# Altium schematic sheet ATACS_SCH.SchDoc
size A
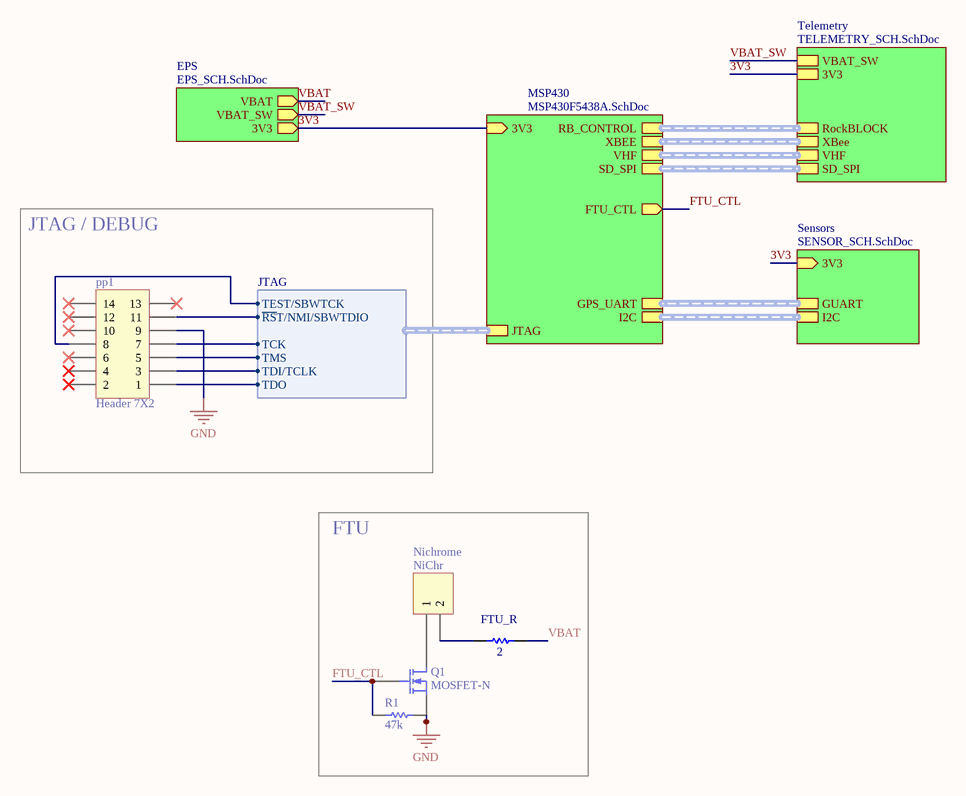
[diagram p0: ATACS_SCH.SchDoc]

## Parts
FTU_R  value 2  [*RES_SMW52R0JT]  (hidden comment: Resistor)
NiChr  Nichrome  [Nichrome]
pp1  Header 7X2  [HDR2X7]
Q1  MOSFET-N  [MOSFET]
R1  value 47k  [J1-0603]  (hidden comment: Resistor)

## Blocks framed on the sheet
JTAG / DEBUG: pp1
FTU: FTU_R NiChr Q1 R1

## Sub-sheets
EPS = EPS_SCH.SchDoc: 3V3 (out), VBAT (out), VBAT_SW (out)
MSP430 = MSP430F5438A.SchDoc: RB_CONTROL (harness RockBLOCK), GPS_UART (harness UART), JTAG (harness JTAG), VHF (harness APRS Transmitter), I2C (harness I2C), XBEE (harness Short-Range XBee), 3V3 (in), FTU_CTL (out), SD_SPI (harness SD)
Sensors = SENSOR_SCH.SchDoc: 3V3 (in), GUART (harness Harness), I2C (harness I2C)
Telemetry = TELEMETRY_SCH.SchDoc: VBAT_SW, 3V3, XBee (harness XBee), VHF (harness VHF), RockBLOCK (harness RockBLOCK), SD_SPI (harness SPI)

## Harnesses
JTAG: ~{RS}T/NMI/SBWTDIO, TCK, TDI/TCLK, TDO, TEST/SBWTCK, TMS

## Nets
GND: pp1.9 Q1.3(S) R1.2
3V3: sheet MSP430/3V3, sheet EPS/3V3, sheet Sensors/3V3, sheet Telemetry/3V3
FTU_CTL: Q1.2(G) R1.1 ; sheet MSP430/FTU_CTL
VBAT: FTU_R.2 ; sheet EPS/VBAT
VBAT_SW: sheet EPS/VBAT_SW, sheet Telemetry/VBAT_SW
NetFTU_R_1: FTU_R.1 NiChr.2
NetNiChr_1: NiChr.1 Q1.1(D)
Netpp1_1: pp1.1 ; sheet MSP430/JTAG.TDO
Netpp1_3: pp1.3 ; sheet MSP430/JTAG.TDI/TCLK
Netpp1_5: pp1.5 ; sheet MSP430/JTAG.TMS
Netpp1_7: pp1.7 ; sheet MSP430/JTAG.TCK
Netpp1_8: pp1.8 ; sheet MSP430/JTAG.TEST/SBWTCK
Netpp1_11: pp1.11 ; sheet MSP430/JTAG.~{RS}T/NMI/SBWTDIO

Not connected (* = marked no-connect by the designer): pp1 2* 4* 6* 10* 12* 13* 14*

## Buses and harness runs
harness sheet MSP430/GPS_UART = sheet Sensors/GUART
harness sheet MSP430/I2C = sheet Sensors/I2C
harness sheet MSP430/RB_CONTROL = sheet Telemetry/RockBLOCK
harness sheet MSP430/SD_SPI = sheet Telemetry/SD_SPI
harness sheet MSP430/VHF = sheet Telemetry/VHF
harness sheet MSP430/XBEE = sheet Telemetry/XBee

## Library data of the parts
FTU_R R1 = Resistor: Resistive element
NiChr = Header 2: Header, 2-Pin; LatestRevisionDate: 17-Jul-2002; LatestRevisionNote: Re-released for DXP Platform.; Publisher: Altium Limited
pp1 = Header 7X2: Header, 7-Pin, Dual row; LatestRevisionDate: 17-Jul-2002; LatestRevisionNote: Re-released for DXP Platform.; Publisher: Altium Limited
Q1 = MOSFET-N: N-Channel MOSFET; pin to pad: 1>2 2>1; Published: 8-Jun-2000; LatestRevisionDate: 17-Jul-2002; LatestRevisionNote: Re-released for DXP Platform.; PackageVersion: 1995/1996; PackageReference: E3; Publisher: Altium Limited; PackageDescription: TO, Flat Index; 3 In-Line, Axial Leads; Body Dia. 4.6mm; Lead Dia. 0.5 mm (max)